# EAGLE design LLC v2 (EAGLE 6.2)
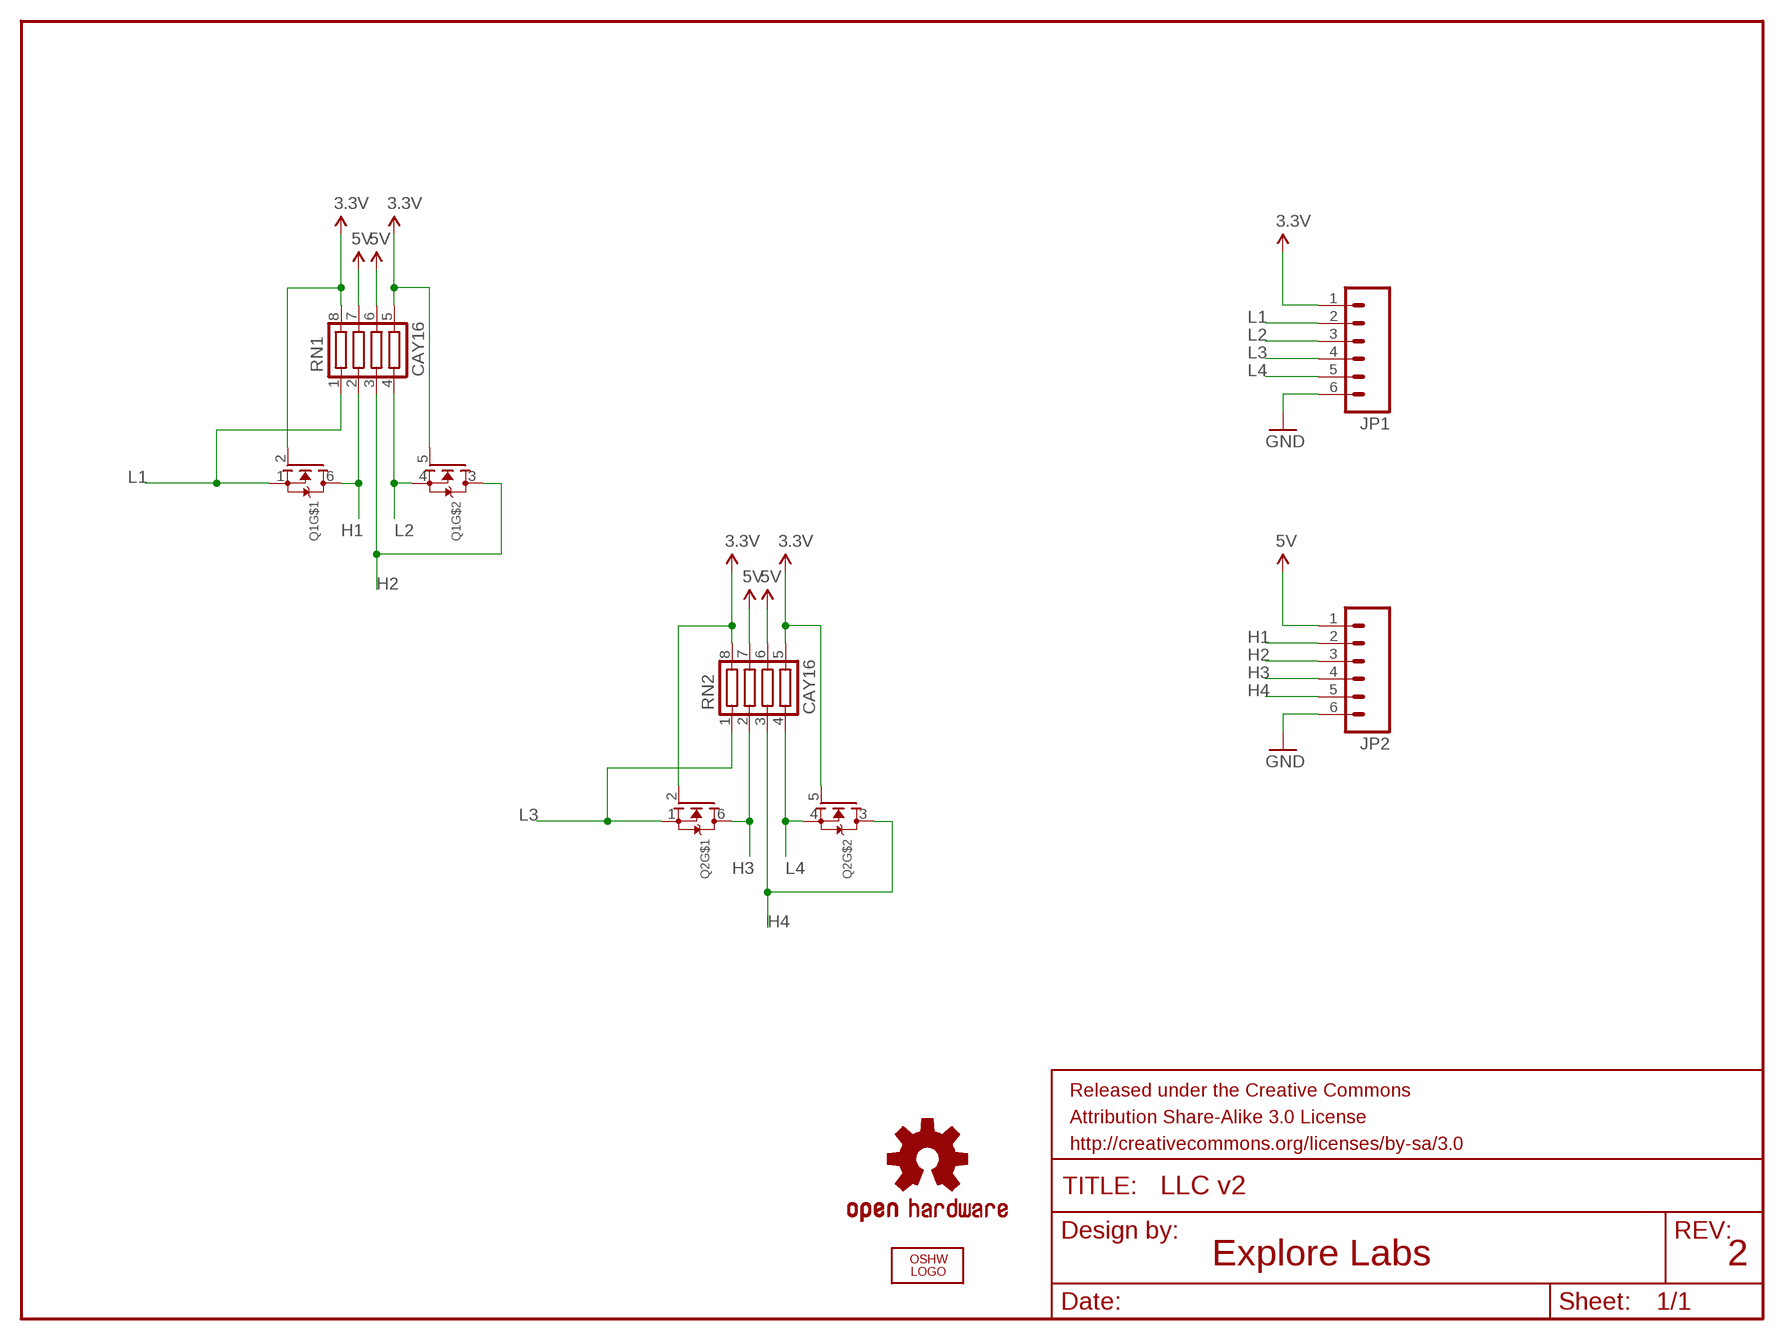
[diagram p0: schematic, sheet 1]

## Parts
JP1  M06SIP  [1X06]
JP2  M06SIP  [1X06]
LOGO1  OSHW_LOGO_FILLX0100-NT  [OSHW_FILLX100_NOTEXT]
Q1  MOSFET-N_DUAL  [SOT363]
Q2  MOSFET-N_DUAL  [SOT363]
RN1  CAY16  [CTS742C083]
RN2  CAY16  [CTS742C083]
U$6  OSHW-LOGOS  [OSHW-LOGO-S]

## Nets
3.3V: JP1.1 Q1.2(G) Q1.5(G) Q2.2(G) Q2.5(G) RN1.5 RN1.8 RN2.5 RN2.8
5V: JP2.1 RN1.6 RN1.7 RN2.6 RN2.7
GND: JP1.6 JP2.6
H1: JP2.2 Q1.6(D) RN1.2
H2: JP2.3 Q1.3(D) RN1.3
H3: JP2.4 Q2.6(D) RN2.2
H4: JP2.5 Q2.3(D) RN2.3
L1: JP1.2 Q1.1(S) RN1.1
L2: JP1.3 Q1.4(S) RN1.4
L3: JP1.4 Q2.1(S) RN2.1
L4: JP1.5 Q2.4(S) RN2.4

## Notes on the sheet
- Explore Labs | 2

## Library data of the parts
JP1 JP2 = SparkFun-Connectors:M06: Header 6 Standard 6-pin 0.1" header. Use with straight break away headers (SKU : PRT-00116), right angle break away headers (PRT-00553), swiss pins (PRT-00743), machine pins (PRT-00117), and female headers (PRT-00115). Molex polarized connector foot print use with SKU : PRT-08094 with associated crimp pins and housings. NOTES ON THE VARIANTS LOCK and LOCK_LONGPADS... This footprint was designed to help hold the alignment of a through-hole component (i.e. 6-pin header) while soldering it into place. You may notice that each hole has been shifted either up or down by 0.005 of an inch from it's more standard position (which is a perfectly straight line). This slight alteration caused the pins (the squares in the middle) to touch the edges of the holes. Because they are alternating, it causes a "brace" to hold the component in place. 0.005 has proven to be the perfect amount of "off-center" position when using our standard breakaway headers. Although looks a little odd when you look at the bare footprint, once you have a header in there, the alteration is very hard to notice. Also, if you push a header all the way into place, it is covered up entirely on the bottom side. This idea of altering the position of holes to aid alignment will be further integrated into the Sparkfun Library for other footprints. It can help hold any component with 3 or more connection pins.
LOGO1 = ohw-logo:OSHW_LOGO_FILL
Q1 Q2 = microbuilder:MOSFET-N_DUAL: Dual N-Channel MOSFET SOT363 (2.0x1.25mm) 2N7002PS - 60V, 320mA [Digikey: 568-5984-1-ND]
RN1 RN2 = 11xLabs:CAY16
U$6 = SparkFun-Aesthetics:OSHW-LOGO: Open Source Hardware Logo This logo indicates the piece of hardware it is found on incorporates a OSHW license and/or adheres to the definition of open source hardware found here: http://freedomdefined.org/OSHW

## Board
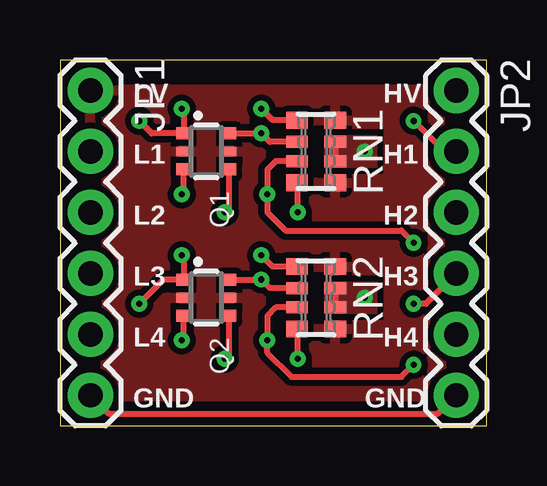
[diagram p1: board, top side]
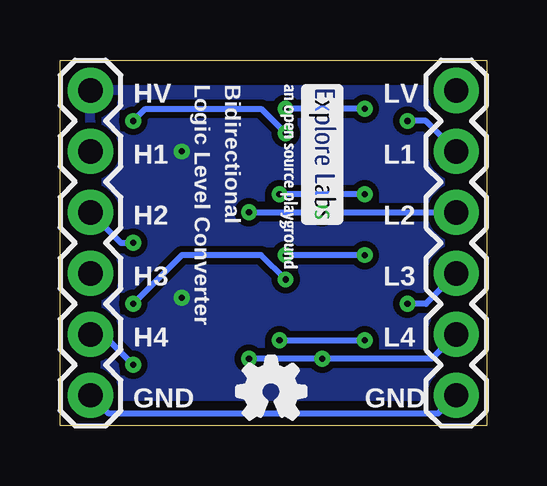
[diagram p2: board, bottom side, seen from below]

Size 17.78 x 15.24 mm. Coordinates in mm from the lower left corner, seen from the top.
Outline: 0,0 17.78,0 17.78,15.24 0,15.24 0,0
Copper layers (1*16): Top 0.035mm / dielectric 1.5mm / Bottom 0.035mm
Design rules: minimum track width 10mil, minimum drill 10mil, track to track 8mil, track to pad 8mil, pad to pad 8mil, via to via 8mil, smd to smd 8mil, copper to edge 40mil, drill to drill 8mil, minimum pad ring 10mil, minimum via ring 8mil, stop-mask expansion 4mil, vias tented up to drill 18mil, thermal gap 10mil

### Footprints (pad centres in the part's own frame; a part is rotated, then mirrored left to right if it is on the bottom)
1X06 = drill 1.016 pad 1.88: 1 0,0; 2 2.54,0; 3 5.08,0; 4 7.62,0; 5 10.16,0; 6 12.7,0
SOT363 = smd 0.5 x 0.6: 1 -0.75,-0.95; 3 0.75,-0.95; 4 0.75,0.95; 6 -0.75,0.95 | smd 0.4 x 0.6: 2 0,-0.95; 5 0,0.95
CTS742C083 = smd 0.7 x 0.9: 1 -1.3,-0.8; 4 1.3,-0.8; 5 1.3,0.8; 8 -1.3,0.8 | smd 0.5 x 0.9: 2 -0.4,-0.8; 3 0.4,-0.8; 6 0.4,0.8; 7 -0.4,0.8

### Placement (x,y rotation side)
JP1  1.27,13.97 270 top
JP2  16.51,13.97 270 top
LOGO1  8.89,-5.33 0 top  (outside the outline)
Q1  6.1,11.43 270 top
Q2  6.1,5.33 270 top
RN1  10.67,11.43 270 top
RN2  10.67,5.33 270 top
U$6  1.52,-6.1 0 top  (outside the outline)
U$14  [EXLABA_LOGO_0.16]  9.14,14.48 270 bottom

### Tracks (layer width: path | path; a pad name or v marks a point on that pad's centre or on a via)
3.3V
  pour Top (isolate 0.254, rank 3): 0,15.24 17.78,15.24 17.78,0 0,0
5V  (via drill 0.25)
  Top 0.254: RN1.7 RN1.6 | RN2.7 RN2.6
  other vias: 12.7,11.43 12.7,5.33
  pour Bottom (isolate 0.254): 0,15.24 17.78,15.24 17.78,0 0,0
  pour Top (isolate 0.254, no thermals): 11.02,12.06 11.02,10.79 13.21,10.79 13.21,12.06
  pour Top (isolate 0.254, no thermals): 11.02,5.97 11.02,4.7 13.21,4.7 13.21,5.97
GND
  Top 0.254: JP1.6 2.03,0.51 15.75,0.51 JP2.6
GND1
  Bottom 0.254: 1.27,1.27 2.03,0.51 15.75,0.51 16.51,1.27
H1  (via drill 0.25)
  Top 0.254: RN1.2 8.74,11.83 v8.38,12.19 8.14,12.18 Q1.6 | JP2.2 16,11.43 v14.73,12.7
  Bottom 0.254: v8.38,12.19 9.4,13.21 14.22,13.21 v14.73,12.7
H2  (via drill 0.25)
  Top 0.254: RN1.3 9,11.03 8.64,10.67 v8.64,9.65 8.64,8.89 9.4,8.13 14.22,8.13 v14.73,7.62 | v5.08,9.65 5.15,9.72 Q1.3
  Bottom 0.254: v5.08,9.65 v8.64,9.65 | JP2.3 15.24,7.62 v14.73,7.62
H3  (via drill 0.25)
  Top 0.254: RN2.2 8.74,5.73 v8.38,6.1 8.14,6.08 Q2.6 | JP2.4 15.24,5.08 v14.73,5.08
  Bottom 0.254: v8.38,6.1 9.4,7.11 12.7,7.11 v14.73,5.08
H4  (via drill 0.25)
  Top 0.254: RN2.3 9,4.93 8.64,4.57 v8.64,3.56 8.64,3.05 9.65,2.03 14.22,2.03 v14.73,2.54 | v5.08,3.56 5.15,3.62 Q2.3
  Bottom 0.254: v8.64,3.56 v5.08,3.56 | JP2.5 16,3.81 v14.73,2.54
L1  (via drill 0.25)
  Top 0.254: v3.3,12.7 3.82,12.18 Q1.1 5.15,13.14 v5.08,13.21 | RN1.1 8.86,12.73 v8.38,13.21
  Bottom 0.254: v5.08,13.21 v8.38,13.21 | JP1.2 2.54,12.7 v3.3,12.7
L2  (via drill 0.25)
  Top 0.254: RN1.4 9.87,10.21 | 7.11,10.56 Q1.4 7.05,9.08 v6.86,8.89 | 9.91,10.19 RN1.4 | v9.91,8.89 9.91,10.09 RN1.4
  Bottom 0.254: JP1.3 v6.86,8.89 v9.91,8.89
L3  (via drill 0.25)
  Top 0.254: v3.3,5.08 4.31,6.08 Q2.1 5.15,7.05 v5.08,7.11 | RN2.1 8.86,6.63 v8.38,7.11
  Bottom 0.254: v5.08,7.11 v8.38,7.11 | JP1.4 2.54,5.08 v3.3,5.08
L4  (via drill 0.25)
  Top 0.254: v6.86,2.79 7.05,2.98 Q2.4 | 9.91,4.1 RN2.4 9.91,4 v9.91,2.79
  Bottom 0.254: v9.91,2.79 v6.86,2.79 2.29,2.79 JP1.5

### Text on the board
_tsilk: LV | HV | L1 | H1 | L2 | H2 | L3 | H3 | L4 | H4 | GND | GND
_bsilk: Bidirectional | Logic Level Converter | LV | HV | L1 | H1 | L2 | H2 | L3 | H3 | L4 | H4 | GND | GND